# Altium schematic sheet 15_PowerSupply.SchDoc: Board power supply (part 2 of 3)
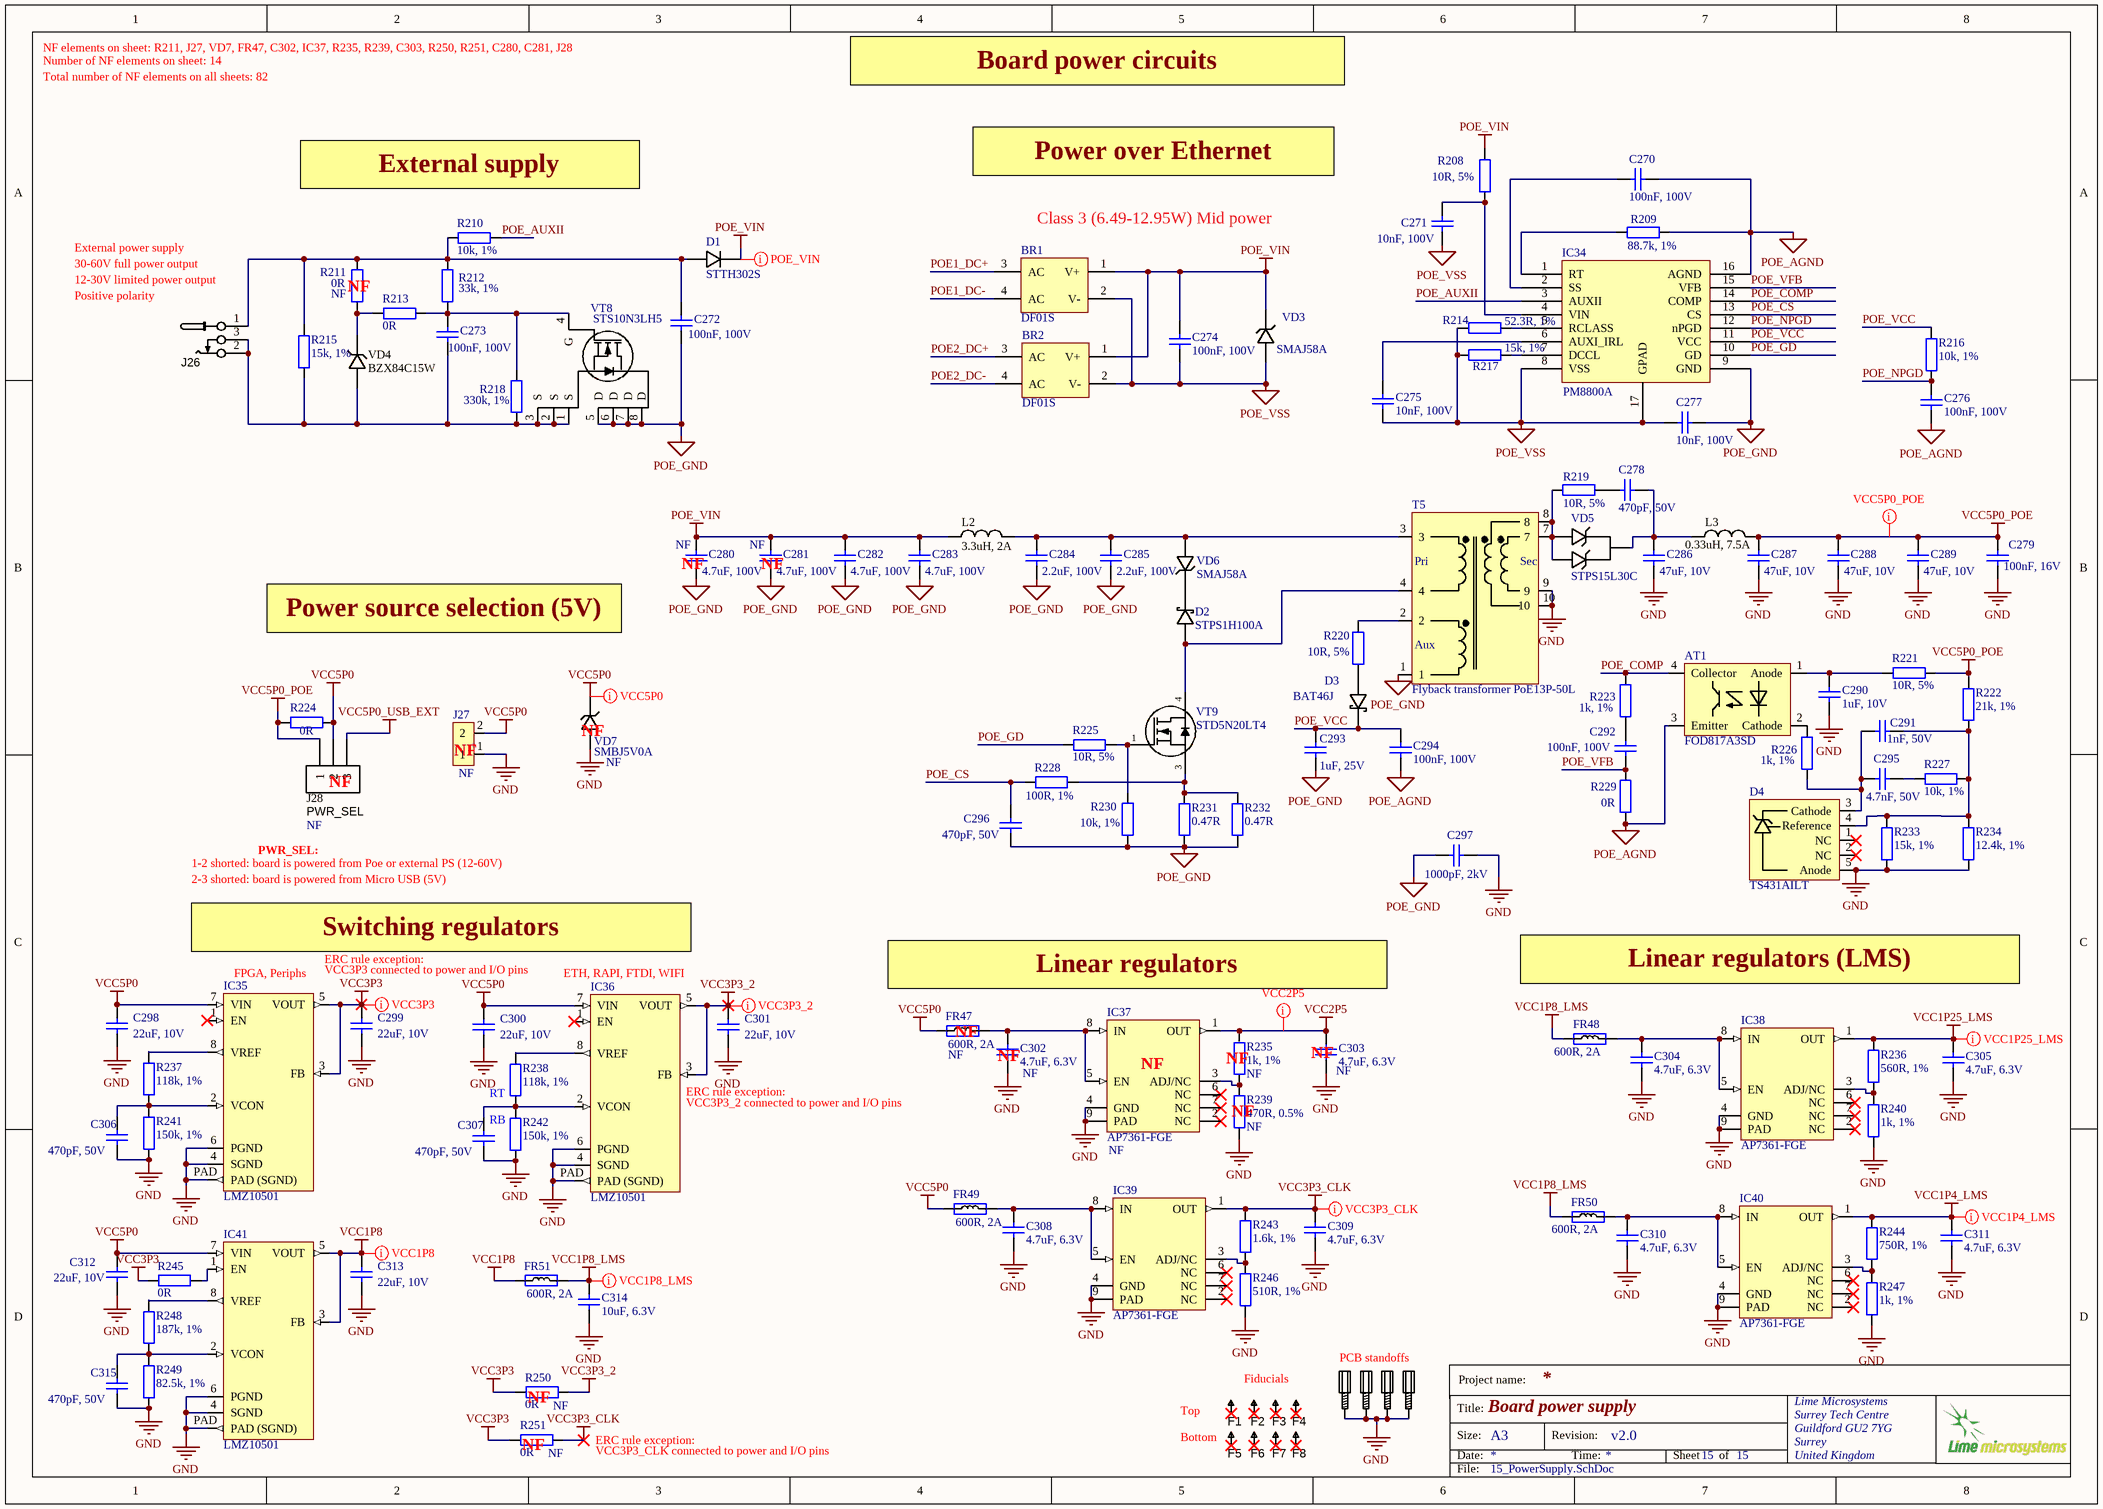
[diagram p1: 15_PowerSupply.SchDoc]
## Library data of the parts
AT1 = FOD817A3SD_optoisolator: Manufacturer: ON Semiconductor / Fairchild; Part Description: Optoisolator Transistor Output 5000Vrms 1 Channel 4-SMD; Number of Channels: 1; Output Voltage: 70V; Forward Current: 50mA; Forward Voltage: 1.4V; Reverse Breakdown Voltage: 6V; Rise Time: 18000ns; Max Power Dissipation: 200mW; Collector Emitter Voltage (VCEO): 200mV; Isolation Voltage: 5kV; Current Transfer Ratio: 160%; Supplier 1: Digi-Key; Manufacturer Part Number 1: FOD817A3SD; Stock 1: 0; Mount: Surface Mount; Case/Package: SMD/SMT; Number of Pins: 4; Weight: 0g; Contact Plating: Matte,Tin; Min Operating Temperature: -55°C; Max Operating Temperature: 110°C; Packaging: Tape and Reel; Package Quantity: 1000; Output Current per Channel: 50mA; Max Collector Current: 50mA; Collector Emitter Saturation Voltage: 200mV; Reverse Voltage (DC): 6V; Fall Time: 18000ns; Number of Elements: 1; Power Dissipation: 200mW; Max Input Current: 50mA; Max Output Voltage: 70V; Input Current: 50mA; Number of Circuits: 1; Radiation Hardening: No; REACH SVHC: No SVHC; Lead Free: Lead Free; ComponentLink1URL: https://www.verical.com/server-webapp/html/getDatasheet?partID=312696; ComponentLink1Description: https://www.verical.com/server-webapp/html/getDatasheet?partID=312696; ComponentLink2URL: https://www.fairchildsemi.com/datasheets/FO/FOD817A.pdf; ComponentLink2Description: https://www.fairchildsemi.com/datasheets/FO/FOD817A.pdf; ComponentLink3URL: http://www.fairchildsemi.com/ds/FO/FOD817A.pdf; ComponentLink3Description: http://www.fairchildsemi.com/ds/FO/FOD817A.pdf; ComponentLink4URL: http://www.fairchildsemi.com/datasheets/FO/FOD817A.pdf; ComponentLink4Description: http://www.fairchildsemi.com/datasheets/FO/FOD817A.pdf; ComponentLink5URL: http://www.mouser.com/ds/2/149/FOD817A-194238.pdf; ComponentLink5Description: http://www.mouser.com/ds/2/149/FOD817A-194238.pdf; ComponentLink6URL: https://www.fairchildsemi.com/datasheets/FO/FOD817D.pdf; ComponentLink6Description: https://www.fairchildsemi.com/datasheets/FO/FOD817D.pdf; Supplier Part Number 1: FOD817A3SDDKR-ND
BR1 BR2 = Bridge2: Diode Bridge; Part Description: Bridge Rectifier Single Phase Standard 100V Surface Mount DF-S; Vf - Forward Voltage: 1.1 V; Vr - Reverse Voltage: 70 V; Peak Reverse Voltage: 100 V; Brand: Diodes Incorporated; Max Surge Current: 50 A; Unit Weight: 0.010547 oz; Ir - Reverse Current: 10 uA; Package / Case: DFS; Product: Bridge Rectifiers; Width: 6.5 mm; Termination Style: SMD/SMT; Product Category: Bridge Rectifiers; Type: Single Phase Bridge; Height: 3.4 mm; Packaging: Tube; Manufacturer: Diodes Incorporated; Series: DF01; Length: 8.51 mm; Supplier Part Number 1: DF01SDI-ND; Factory Pack Quantity: 50; Mounting Style: PCB Mount; Manufacturer Part Number 1: DF01S; RoHS: True; Minimum Operating Temperature: - 65 C; Supplier 1: Digi-Key; Maximum Operating Temperature: + 150 C
C270 C272-C274 C276 C292 C294 = Cap_0805: Manufacturer: Murata Electronics North America; Part Description: 0.1µF ±10% 100V Ceramic Capacitor X7R 0805 (2012 Metric); Manufacturer Part Number 1: GCM21BR72A104KA37K; Temperature Coefficient: X7R; Tolerance: ±10%; Package / Case: 0805 (2012 Metric); Size / Dimension: 0.079" L x 0.049" W (2.00mm x 1.25mm); Lead Style: -; Height - Seated (Max): -; Thickness (Max): 0.055" (1.40mm); Lead Spacing: -; Ratings: AEC-Q200; Supplier Part Number 1: 490-8051-1-ND; Features: -; Operating Temperature: -55°C ~ 125°C; Supplier 1: Digi-Key; RoHS: RoHS Compliant; Part Status: Active; Mounting Type: Surface Mount, MLCC; Category: Capacitors; Packaging: Cut Tape (CT); Applications: Automotive; Voltage - Rated: 100V; Value: 100nF, 100V
C271 C275 C277 = Cap_0603: Manufacturer: Murata Electronics North America; Manufacturer Part Number 1: GCM188R72A103KA37J; Part Description: 10000pF ±10% 100V Ceramic Capacitor X7R 0603 (1608 Metric); Tolerance: ±10%; Temperature Coefficient: X7R; Assembly Info: *; Packaging: Cut Tape (CT); Ratings: AEC-Q200; Supplier Part Number 1: 490-8028-1-ND; Size / Dimension: 0.063" L x 0.031" W (1.60mm x 0.80mm); Applications: Automotive; Voltage - Rated: 100V; Height - Seated (Max): -; Lead Style: -; Category: Capacitors; RoHS: RoHS Compliant; Package / Case: 0603 (1608 Metric); Operating Temperature: -55°C ~ 125°C; Lead Spacing: -; Supplier 1: Digi-Key; Features: -; Thickness (Max): 0.035" (0.90mm); Mounting Type: Surface Mount, MLCC; Part Status: Active; Value: 10nF, 100V
C278 C296 C306 C307 C315 = Cap_0402: Manufacturer Part Number: C1005C0G1H471J050BA; Manufacturer: TDK Corporation; Part Description: 470pF ±5% 50V Ceramic Capacitor C0G, NP0 0402 (1005 Metric); Tolerance: ±5%; Temperature Coefficient: C0G, NP0; Value: 470pF, 50V; Supplier 1: Digi-Key; Supplier Part Number 1: 445-2656-6-ND; Ratings: -; Package / Case: 0402 (1005 Metric); Capacitance: 470pF; Packaging: Digi-Reel®; RoHS: RoHS Compliant; Lead Style: -; Thickness (Max): 0.022" (0.55mm); Size / Dimension: 0.039" L x 0.020" W (1.00mm x 0.50mm); Lead Spacing: -; Operating Temperature: -55°C ~ 125°C; Height - Seated (Max): -; Applications: General Purpose; Mounting Type: Surface Mount, MLCC; Voltage - Rated: 50V; Category: Capacitors; Features: -
C279 = Cap_0402: Manufacturer: Murata Electronics; Manufacturer Part Number: GRM155R71C104KA88D; Part Description: CAP CER 0.1UF 16V X7R 0402; Tolerance: 10 %; Type: General Purpose MLCC; Capacitance: 0.1 uF; Case Length: 1 mm; Dielectric: X7R; Case Height: 0.5 mm; Temperature Coefficient / Code: +/- 15 %; Value: 100nF, 16V; Supplier 1: Mouser; Supplier Part Number 1: 81-GRM155R71C104KA88; Case Code - in: 0402; RoHS: RoHS Compliant; Operating Temperature Range: - 55 C to + 125 C; Series: GRM; Termination Style: SMD/SMT; Package / Case: 0402 (1005 metric); Voltage Rating DC: 16 V; Maximum Operating Temperature: + 125 C; Case Code - mm: 1005; Minimum Operating Temperature: - 55 C; Product Category: Low & Medium Capacitance SMD Ceramic Chip Capacitors; Packaging: Reel; Product: General Type MLCCs; Category: Multilayer Ceramic Capacitors MLCC - SMD/SMT; Brand: Murata Electronics; Case Width: 0.5 mm; RoHS - Mouser: Y; Standard Pack Qty: 10000; Minimum Order Quantity: 1; Reeling: True; Manufacturer Part Number 1: GRM155R71C104KA88D
C280-C283 = Cap_1206: Manufacturer: TDK Corporation; Part Description: 4.7µF ±20% 100V Ceramic Capacitor X7S 1210 (3225 Metric); Manufacturer Part Number 1: C3225X7S2A475M200AB; Tolerance: ±20%; Temperature Coefficient: X7S; Notification: Current market demand for these product types have resulted in fluctuating and extending lead times. Lead times may differ.; Value: 4.7uF, 100V; Category: Capacitors; Supplier Part Number 1: 445-6043-1-ND; Supplier 1: Digi-Key; RoHS: RoHS Compliant; Packaging: Cut Tape (CT); Part Status: Active; Voltage - Rated: 100V; Operating Temperature: -55°C ~ 125°C; Features: -; Ratings: -; Applications: General Purpose; Failure Rate: -; Mounting Type: Surface Mount, MLCC; Package / Case: 1210 (3225 Metric); Size / Dimension: 0.126" L x 0.098" W (3.20mm x 2.50mm); Height - Seated (Max): -; Thickness (Max): 0.087" (2.20mm); Lead Spacing: -; Lead Style: -
C284 C285 = Cap_1206: Manufacturer: TDK Corporation; Part Description: 2.2µF ±10% 100V Ceramic Capacitor X7S 1206 (3216 Metric); Manufacturer Part Number 1: C3216X7S2A225K160AE; Temperature Coefficient: X7S; Tolerance: ±10%; Size / Dimension: 0.126" L x 0.063" W (3.20mm x 1.60mm); Packaging: Cut Tape (CT); Voltage - Rated: 100V; Category: Capacitors; Operating Temperature: -55°C ~ 125°C; Mounting Type: Surface Mount, MLCC; Lead Spacing: -; Ratings: -; Supplier Part Number 1: 445-8900-1-ND; Lead Style: -; Height - Seated (Max): -; Supplier 1: Digi-Key; Applications: Boardflex Sensitive; Features: Soft Termination; RoHS: RoHS Compliant; Part Status: Active; Thickness (Max): 0.075" (1.90mm); Failure Rate: -; Package / Case: 1206 (3216 Metric); Value: 2.2uF, 100V
C286-C289 = Cap_1206: Manufacturer: TDK Corporation; Manufacturer Part Number 1: C3216X6S1A476M160AC; Part Description: 47µF ±20% 10V Ceramic Capacitor X6S 1206 (3216 Metric); Notification: Current market demand for these product types have resulted in fluctuating and extending lead times. Lead times may differ.; Tolerance: ±20%; Temperature Coefficient: X6S; Value: 47uF, 10V; RoHS: RoHS Compliant; Packaging: Cut Tape (CT); Operating Temperature: -55°C ~ 105°C; Voltage - Rated: 10V; Height - Seated (Max): -; Ratings: -; Applications: General Purpose; Features: Low ESL; Size / Dimension: 0.126" L x 0.063" W (3.20mm x 1.60mm); Supplier 1: Digi-Key; Lead Spacing: -; Supplier Part Number 1: 445-6010-1-ND; Thickness (Max): 0.071" (1.80mm); Failure Rate: -; Category: Capacitors; Lead Style: -; Part Status: Active; Mounting Type: Surface Mount, MLCC; Package / Case: 1206 (3216 Metric)
C290 = Cap_0402: CAP CER 1UF 10V X5R 0402; Manufacturer: Yageo; Part Description: 1µF 10V Ceramic Capacitor X5R 0402 (1005 Metric) 0.039" L x 0.020" W (1.00mm x 0.50mm); Manufacturer Part Number: CC0402MRX5R6BB105; Notification: Current market demand for these product types have resulted in fluctuating and extending lead times. Lead times may differ.; Tolerance: ±20%; Value: 1uF, 10V; Supplier 1: Digi-Key; Supplier Part Number 1: 311-1732-1-ND; RoHS: RoHS Compliant; Applications: General Purpose; Category: Capacitors; ComponentLink1Description: http://www.yageo.com/documents/recent/UPY-GPHC_X5R_4V-to-50V_25.pdf; ComponentLink1URL: http://www.yageo.com/documents/recent/UPY-GPHC_X5R_4V-to-50V_25.pdf; Failure Rate: -; Features: -; Height - Seated (Max): -; Lead Spacing: -; Lead Style: -; Mounting Type: Surface Mount, MLCC; Operating Temperature: -55°C ~ 85°C; Package / Case: 0402 (1005 Metric); Packaging: Cut Tape (CT); Part Status: Active; Pricing 1: 1=0.22, 10=0.156, 100=0.0732, 500=0.0513, 1000=0.04248, 2500=0.03953, 5000=0.03617 (USD); Ratings: -; Size / Dimension: 0.039" L x 0.020" W (1.00mm x 0.50mm); Stock 1: 69600; Temperature Coefficient: X5R; Thickness (Max): 0.022" (0.55mm); Voltage - Rated: 10V
C291 = Cap_0402: Manufacturer: Murata Electronics North America; Part Description: 1000pF ±10% 50V Ceramic Capacitor X7R 0402 (1005 Metric); Manufacturer Part Number 1: GCM155R71H102KA37D; Temperature Coefficient: X7R; Tolerance: ±10%; Height - Seated (Max): -; Operating Temperature: -55°C ~ 125°C; Ratings: AEC-Q200; Package / Case: 0402 (1005 Metric); Lead Style: -; Size / Dimension: 0.039" L x 0.020" W (1.00mm x 0.50mm); Lead Spacing: -; Thickness (Max): 0.022" (0.55mm); Mounting Type: Surface Mount, MLCC; Features: -; Voltage - Rated: 50V; Applications: Automotive; Part Status: Active; Packaging: Cut Tape (CT); RoHS: RoHS Compliant; Category: Capacitors; Supplier Part Number 1: 490-4761-1-ND; Supplier 1: Digi-Key; Value: 1nF, 50V
C293 = Cap_0603: Manufacturer: Samsung Electro-Mechanics; Manufacturer Part Number 1: CL10A105KA8NNNC; Part Description: 1µF ±10% 25V Ceramic Capacitor X5R 0603 (1608 Metric); Notification: Current market demand for these product types have resulted in fluctuating and extending lead times. Lead times may differ.; Temperature Coefficient: X5R; Tolerance: ±10%; Lead Spacing: -; Lead Style: -; Thickness (Max): 0.035" (0.90mm); Features: -; Operating Temperature: -55°C ~ 85°C; Size / Dimension: 0.063" L x 0.031" W (1.60mm x 0.80mm); Height - Seated (Max): -; Applications: General Purpose; Mounting Type: Surface Mount, MLCC; Package / Case: 0603 (1608 Metric); Ratings: -; Supplier Part Number 1: 1276-1102-1-ND; Packaging: Cut Tape (CT); Voltage - Rated: 25V; RoHS: RoHS Compliant; Supplier 1: Digi-Key; Category: Capacitors; Part Status: Active; Value: 1uF, 25V
C295 = Cap_0402: Manufacturer: Murata Electronics North America; Manufacturer Part Number 1: GCM155R71H472KA37D; Part Description: 4700pF ±10% 50V Ceramic Capacitor X7R 0402 (1005 Metric); Tolerance: ±10%; Temperature Coefficient: X7R; Voltage - Rated: 50V; Packaging: Cut Tape (CT); Operating Temperature: -55°C ~ 125°C; Package / Case: 0402 (1005 Metric); Thickness (Max): 0.022" (0.55mm); Features: -; Supplier Part Number 1: 490-4915-1-ND; Ratings: AEC-Q200; Applications: Automotive; Size / Dimension: 0.039" L x 0.020" W (1.00mm x 0.50mm); Part Status: Active; Lead Spacing: -; Lead Style: -; Supplier 1: Digi-Key; Height - Seated (Max): -; Mounting Type: Surface Mount, MLCC; RoHS: RoHS Compliant; Category: Capacitors; Value: 4.7nF, 50V
C297 = Cap_1206: Manufacturer Part Number 1: C1812C102KGRACTU; Manufacturer: KEMET; Part Description: 1000pF ±10% 2000V (2kV) Ceramic Capacitor X7R 1812 (4532 Metric); Tolerance: ±10%; Notification: Current market demand for these product types have resulted in fluctuating and extending lead times. Lead times may differ.; Voltage - Rated: 2000V (2kV); Temperature Coefficient: X7R; Packaging: Cut Tape (CT); Supplier Part Number 1: 399-3447-1-ND; Supplier 1: Digi-Key; Part Status: Active; Category: Capacitors; RoHS: RoHS Compliant; Mounting Type: Surface Mount, MLCC; Applications: General Purpose; Lead Style: -; Ratings: -; Height - Seated (Max): -; Thickness (Max): 0.061" (1.55mm); Size / Dimension: 0.177" L x 0.126" W (4.50mm x 3.20mm); Package / Case: 1812 (4532 Metric); Failure Rate: -; Lead Spacing: -; Features: High Voltage; Operating Temperature: -55°C ~ 125°C; Value: 1000pF, 2kV
C298-C301 C312 C313 = Cap_0603: Manufacturer Part Number 1: C1608X5R1A226M080AC; Manufacturer: TDK Corporation; Part Description: 22µF ±20% 10V X5R Ceramic Capacitor -55°C ~ 85°C Surface Mount, MLCC 0603 (1608 Metric) 0.063" L x 0.031" W (1.60mm x 0.80mm); Brand: TDK; Temperature Coefficient / Code: +/- 15 %; Tolerance: 20 %; Type: Multilayer Ceramic Chip Capacitor; Supplier 1: Mouser; Supplier Part Number 1: 810-C1608X5R1A226M; Package / Case: 0603 (1608 metric); Category: Multilayer Ceramic Capacitors MLCC - SMD/SMT; Capacitance: 22 uF; Operating Temperature Range: - 55 C to + 85 C; Case Code - in: 0603; Voltage Rating DC: 10 V; Case Code - mm: 1608; Value: 22uF, 10V
C302-C305 C308-C311 = Cap_0402: Manufacturer: Murata Electronics North America; Manufacturer Part Number: GRM155R60J475ME87D; Part Description: 4.7µF ±20% 6.3V X5R Ceramic Capacitor -55°C ~ 85°C Surface Mount, MLCC 0402 (1005 Metric) 0.039" L x 0.020" W (1.00mm x 0.50mm); Tolerance: ±20%; Capacitance: 4.7µF; Temperature Coefficient: X5R; Lead Style: -; Ratings: -; Height - Seated (Max): -; Thickness (Max): 0.022" (0.55mm); Voltage - Rated: 6.3V; Packaging: Cut Tape (CT); Lead Spacing: -; Category: Capacitors; Supplier Part Number 1: 490-5408-1-ND; Applications: General Purpose; Operating Temperature: -55°C ~ 85°C; Mounting Type: Surface Mount, MLCC; Features: Derating Recommended; RoHS: RoHS Compliant; Supplier 1: Digi-Key; Package / Case: 0402 (1005 Metric); Size / Dimension: 0.039" L x 0.020" W (1.00mm x 0.50mm); Value: 4.7uF, 6.3V
C314 = Cap_0603: Manufacturer Part Number 1: CC0603MRX5R5BB106; Manufacturer: Yageo; Part Description: 10µF ±20% 6.3V X5R Ceramic Capacitor -55°C ~ 85°C Surface Mount, MLCC 0603 (1608 Metric) 0.063" L x 0.031" W (1.60mm x 0.80mm); Capacitance: 10µF; Tolerance: ±20%; Supplier 1: Digi-Key; Supplier Part Number 1: 311-1448-2-ND; Package / Case: 0603 (1608 Metric); Category: Capacitors; Voltage - Rated: 6.3V; Value: 10uF, 6.3V
D1 = STTH302S_diode: Part Description: Diode Standard 200V 3A Surface Mount SMC; Manufacturer: STMicroelectronics; Max Surge Current: 100A; Recovery Time: 35ns; Forward Voltage: 950mV; Forward Current: 3A; Peak Reverse Current: 3uA; Max Repetitive Reverse Voltage (Vrrm): 200V; Element Configuration: Single; Polarity: Standard; Supplier 1: Digi-Key; Manufacturer Part Number 1: STTH302S; Stock 1: 8931; Pricing 1: 1=0.78, 10=0.683, 100=0.5237, 500=0.414, 1000=0.3312 (USD); Mount: Stud,Surface Mount; Case/Package: SMC; Number of Pins: 2; Min Operating Temperature: -65°C; Max Operating Temperature: 175°C; Package Quantity: 1; Packaging: Tape and Reel; Average Rectified Current: 3A; Reverse Recovery Time: 35ns; Peak Non-Repetitive Surge Current: 100A; Max Forward Surge Current (Ifsm): 100A; Voltage Rating (DC): 200V; Current Rating: 3A; Output Current: 3A; Reverse Voltage: 200V; Max Reverse Voltage (DC): 200V; Length: 7.15mm; Height: 2.45mm; Width: 6.25mm; Radiation Hardening: No; REACH SVHC: No SVHC; Lead Free: Lead Free; ComponentLink1URL: http://www.st.com/web/catalog/sense_power/FM64/CL830/SC4/PF70422?referrer=70032480; ComponentLink1Description: http://www.st.com/web/catalog/sense_power/FM64/CL830/SC4/PF70422?referrer=70032480; ComponentLink2URL: http://www.st.com/st-web-ui/static/active/en/resource/technical/document/datasheet/CD00002930.pdf; ComponentLink2Description: http://www.st.com/st-web-ui/static/active/en/resource/technical/document/datasheet/CD00002930.pdf; ComponentLink3URL: https://www.distrelec.biz/Web/Downloads/29/30/CD00002930.pdf?mime=application%2Fpdf; ComponentLink3Description: https://www.distrelec.biz/Web/Downloads/29/30/CD00002930.pdf?mime=application%2Fpdf; ComponentLink4URL: http://www.st.com/content/ccc/resource/technical/document/datasheet/bc/ad/88/88/7d/b3/47/3b/CD00002930.pdf/files/CD00002930.pdf/jcr:content/translations/en.CD00002930.pdf; ComponentLink4Description: http://www.st.com/content/ccc/resource/technical/document/datasheet/bc/ad/88/88/7d/b3/47/3b/CD00002930.pdf/files/CD00002930.pdf/jcr:content/translations/en.CD00002930.pdf; Supplier Part Number 1: 497-5230-6-ND
D2 = STPS1H100A_shottky_diode: Part Description: Diode Schottky 100V 1A Surface Mount SMA (DO-214AC); Manufacturer: STMicroelectronics; Forward Current: 1A; Max Surge Current: 50A; Forward Voltage: 620mV; Peak Reverse Current: 4uA; Max Repetitive Reverse Voltage (Vrrm): 100V; Element Configuration: Single; Polarity: Standard; Supplier 1: Digi-Key; Manufacturer Part Number 1: STPS1H100A; Stock 1: 171196; Pricing 1: 1=0.46, 10=0.397, 100=0.2965, 500=0.23294, 1000=0.18 (USD); Mount: Surface Mount; Case/Package: SMA; Number of Pins: 2; Weight: 0.01lb; Contact Plating: Matte,Tin; Min Operating Temperature: -65°C; Max Operating Temperature: 175°C; Package Quantity: 1; Packaging: Tape and Reel; Average Rectified Current: 1A; Max Reverse Leakage Current: 4uA; Max Forward Surge Current (Ifsm): 50A; Peak Non-Repetitive Surge Current: 50A; Termination: SMD/SMT; Voltage Rating (DC): 100V; Output Current: 1A; Current Rating: 1A; Max Reverse Voltage (DC): 100V; Length: 4.6mm; Height: 2.03mm; Width: 2.95mm; Radiation Hardening: No; REACH SVHC: No SVHC; Lead Free: Lead Free; ComponentLink1URL: https://www.distrelec.biz/Web/Downloads/13/04/CD00001304.pdf?mime=application%2Fpdf; ComponentLink1Description: https://www.distrelec.biz/Web/Downloads/13/04/CD00001304.pdf?mime=application%2Fpdf; ComponentLink2URL: http://www.st.com/content/ccc/resource/technical/document/datasheet/e8/3c/6a/07/72/b0/40/88/CD00001304.pdf/files/CD00001304.pdf/jcr:content/translations/en.CD00001304.pdf; ComponentLink2Description: http://www.st.com/content/ccc/resource/technical/document/datasheet/e8/3c/6a/07/72/b0/40/88/CD00001304.pdf/files/CD00001304.pdf/jcr:content/translations/en.CD00001304.pdf; ComponentLink3URL: http://www.farnell.com/datasheets/1690209.pdf; ComponentLink3Description: http://www.farnell.com/datasheets/1690209.pdf; Supplier Part Number 1: 497-3209-6-ND
D3 = BAT46JFILM_shottky_diode: Manufacturer: STMicroelectronics; Part Description: Diode Schottky 100V 150mA (DC) Surface Mount SOD-323; Diode Type: Schottky; Current - Average Rectified (Io): 150mA (DC); Speed: Small Signal =< 200mA (Io), Any Speed; Capacitance @ Vr, F: 10pF @ 0V, 1MHz; Supplier 1: Digi-Key; Supplier Part Number 1: 497-6653-6-ND; Manufacturer Part Number 1: BAT46JFILM; RoHS: RoHS Compliant; Category: Discrete Semiconductor Products; Stock 1: 137606; Pricing 1: 1=0.48, 10=0.36, 100=0.2074, 500=0.14, 1000=0.1092 (USD); Packaging: Digi-Reel®; Part Status: Active; Mounting Type: Surface Mount; Package / Case: SC-76, SOD-323; Supplier Device Package: SOD-323; Operating Temperature - Junction: 150°C (Max); Base Part Number: BAT46; ComponentLink1URL: http://www.st.com/content/ccc/resource/technical/document/datasheet/c6/32/d4/4a/28/d3/4b/11/CD00004930.pdf/files/CD00004930.pdf/jcr:content/translations/en.CD00004930.pdf; ComponentLink1Description: http://www.st.com/content/ccc/resource/technical/document/datasheet/c6/32/d4/4a/28/d3/4b/11/CD00004930.pdf/files/CD00004930.pdf/jcr:content/translations/en.CD00004930.pdf
D4 = TS431AILT_VREF_ADJ: Manufacturer: STMicroelectronics; Part Description: Shunt Voltage Reference IC 6V ±1% 30mA SOT-23-5; Nominal Supply Current: 30mA; Output Voltage: 6V; Max Input Voltage: 10V; Number of Channels: 1; Tolerance: 1%; Temperature Coefficient: 100ppm/°C; Cathode Current: 60uA; Reference Voltage: 1.24V; Min Output Voltage: 1.228V; Reference Type: Adjustable,Shunt; Supplier 1: Digi-Key; Manufacturer Part Number 1: TS431AILT; Stock 1: 5120; Pricing 1: 1=0.62, 10=0.533, 100=0.398, 500=0.3127, 1000=0.24164 (USD); Mount: Surface Mount; Case/Package: SOT-23-5; Number of Pins: 5; Min Operating Temperature: -40°C; Max Operating Temperature: 125°C; Packaging: Tape and Reel; Max Output Current: 30mA; Package Quantity: 1; Output Current: 30mA; Max Output Voltage: 6V; Termination: SMD/SMT; Length: 3mm; Height: 1.3mm; Width: 1.75mm; Radiation Hardening: No; REACH SVHC: No SVHC; Lead Free: Lead Free; ComponentLink1URL: https://www.verical.com/server-webapp/html/getDatasheet?partID=139054; ComponentLink1Description: https://www.verical.com/server-webapp/html/getDatasheet?partID=139054; ComponentLink2URL: http://www.st.com/content/ccc/resource/technical/document/datasheet/group1/3f/2e/70/d8/11/ee/47/a9/CD00001336/files/CD00001336.pdf/jcr:content/translations/en.CD00001336.pdf; ComponentLink2Description: http://www.st.com/content/ccc/resource/technical/document/datasheet/group1/3f/2e/70/d8/11/ee/47/a9/CD00001336/files/CD00001336.pdf/jcr:content/translations/en.CD00001336.pdf; ComponentLink3URL: http://www.st.com/web/en/resource/technical/document/datasheet/CD00001336.pdf; ComponentLink3Description: http://www.st.com/web/en/resource/technical/document/datasheet/CD00001336.pdf; ComponentLink4URL: http://www.farnell.com/datasheets/1700526.pdf; ComponentLink4Description: http://www.farnell.com/datasheets/1700526.pdf; ComponentLink5URL: http://www.mouser.com/ds/2/389/ts431-957324.pdf; ComponentLink5Description: http://www.mouser.com/ds/2/389/ts431-957324.pdf; ComponentLink6URL: http://www.produktinfo.conrad.com/datenblaetter/1100000-1199999/001185084-da-01-en-IC_VREF_SHUNT_PRE_TS431AILT_SOT_23_5_STM.pdf; ComponentLink6Description: http://www.produktinfo.conrad.com/datenblaetter/1100000-1199999/001185084-da-01-en-IC_VREF_SHUNT_PRE_TS431AILT_SOT_23_5_STM.pdf; ComponentLink7URL: http://datasheet.iiic.cc/stmicroelectronics/TS431AILT.pdf; ComponentLink7Description: http://datasheet.iiic.cc/stmicroelectronics/TS431AILT.pdf; Supplier Part Number 1: 497-2279-6-ND
FR47-FR51 = Ferrite: Manufacturer Part Number 1: MPZ2012S601AT000; Manufacturer: TDK Corporation; Part Description: FERRITE BEAD 600 OHM 0805 1LN; Filter Type: Differential Mode - Single; Impedance @ Frequency: 600 Ohm @ 100MHz; DC Resistance (DCR): 100 mOhm Max; Supplier 1: Digi-Key; Supplier Part Number 1: 445-2206-2-ND; Mounting Type: Surface Mount; RoHS: RoHS Compliant; Height (Max): 0.041" (1.05mm); Packaging: Tape & Reel (TR); Category: Filters; Current Rating: 2A; Package / Case: 0805 (2012 Metric); Size / Dimension: 0.079" L x 0.049" W (2.00mm x 1.25mm)
  FR48 FR50: Value: 600R, 2A
IC34 = PM8800A: Manufacturer: STMicroelectronics; Part Description: Power Over Ethernet Controller 1 Channel 802.3af (PoE) 16-HTSSOP; Internal Switch(s): No; Other Related Documents: PM8800 View All Specifications; Current Limit: 800mA; Voltage - Supply: -; Category: Integrated Circuits (ICs); Supplier Part Number 1: 497-16438-ND; Supplier Device Package: 16-HTSSOP; Family: PMIC - Hot Swap, PoE Controllers; Package / Case: 16-TSSOP (0.173", 4.40mm Width) Exposed pad; Supplier: Digi-Key; Type: Power Over Ethernet Controller (PoE); Standard Package: 1,920; Series: -; Mounting Type: Surface Mount; Operating Temperature: -40°C ~ 85°C; Manufacturer Part Number 1: PM8800A; Applications: General Purpose; Packaging: Tape & Reel (TR)
IC35 IC36 IC41 = LMZ10501: Manufacturer: Texas Instruments; Manufacturer Part Number: LMZ10501SILR; Part Description: n  Non-Isolated PoL Module DC DC Converter 1 Output 0.6 ~ 3.6 V 1A 2.7V - 5.5V Input; Voltage - Input (Min): 2.7V; Voltage - Input (Max): 5.5V; Voltage - Output 1: 0.6 ~ 3.6 V; Current - Output (Max): 1A; Efficiency: 95%; Supplier 1: Digi-Key; RoHS: RoHS Compliant; Category: Power Supplies - Board Mount; Stock 1: 26559; Pricing 1: 1=2.46, 5=2.424, 10=2.388, 25=2.318, 50=2.2478, 100=2.1776, 250=2.1074, 500=1.96688 (USD); Packaging: Cut Tape (CT); Part Status: Active; Type: Non-Isolated PoL Module; Voltage - Output 2: -; Voltage - Output 3: -; Applications: ITE (Commercial); Features: OCP, OTP, UVLO; Operating Temperature: -40°C ~ 125°C; Mounting Type: Surface Mount; Package / Case: 8-LDFN Exposed Pad, Module; Size / Dimension: 0.12" L x 0.10" W x 0.03" H (3.0mm x 2.5mm x 0.7mm); Supplier Device Package: 8-uSIP; ComponentLink1URL: http://www.ti.com/lit/ds/symlink/lmz10501.pdf; ComponentLink1Description: http://www.ti.com/lit/ds/symlink/lmz10501.pdf; Supplier Part Number 1: 296-37104-1-ND
IC37 = AP7361: Manufacturer Part Number: AP7361-FGE-7; Manufacturer: Diodes Incorporated; Part Description: IC REG LDO ADJ 1A 8DFN; Regulator Topology: Positive Adjustable; Current - Output: 1A; Current - Limit (Min): 1.1A; Voltage - Dropout (Typical): 0.5V @ 1A; Voltage - Output: 0.8 V ~ 5.5 V; Number of Regulators: 1; Voltage - Input: 2.2 V ~ 6 V; Supplier 1: Digi-Key; Supplier Part Number 1: AP7361-FGE-7DICT-ND; RoHS: RoHS Compliant; Supplier Device Package: U-DFN3030-8; Mounting Type: Surface Mount; Category: Integrated Circuits (ICs); Packaging: Cut Tape (CT); Package / Case: 8-UDFN Exposed Pad; Operating Temperature: -40°C ~ 85°C
IC38-IC40 = AP7361: Manufacturer Part Number 1: AP7361-FGE-7; Manufacturer: Diodes Incorporated; Part Description: IC REG LDO ADJ 1A 8DFN; Regulator Topology: Positive Adjustable; Current - Output: 1A; Current - Limit (Min): 1.1A; Voltage - Dropout (Typical): 0.5V @ 1A; Voltage - Output: 0.8 V ~ 5.5 V; Number of Regulators: 1; Voltage - Input: 2.2 V ~ 6 V; Supplier 1: Digi-Key; Supplier Part Number 1: AP7361-FGE-7DICT-ND; RoHS: RoHS Compliant; Supplier Device Package: U-DFN3030-8; Mounting Type: Surface Mount; Category: Integrated Circuits (ICs); Packaging: Cut Tape (CT); Package / Case: 8-UDFN Exposed Pad; Operating Temperature: -40°C ~ 85°C
J26 = CONN_PWR_JACK_2.1x5.5mm: Power Connector, THT, 2.1mm ID, 5.5mm OD; Part Description: DC Power Connector, Jack, 5 A, 2.5 mm, Through Hole Mount, Solder; Manufacturer: Switchcraft; Manufacturer Part Number 1: RAPC712X; Description: CONN POWERJACK MINI R/A PCMT; Body Material: Thermoplastic; Current Rating: 5A; Gender: Male; Shielding: Unshielded; Connector Type: Jack,Power; Insulation Resistance: 30MR; Number of Ports: 1; Number of Contacts: 2; Supplier 1: Farnell; Supplier Part Number 1: 1608726; Stock 1: 6232; Pricing 1: 1=5.315 (EUR); Mount: Panel,PCB,Through Hole; Contact Material: Brass; Contact Plating: Nickel; Colour: Black; Number of Terminals: 3; Housing Colour: Black; Housing Material: Thermoplastic; Packaging: Bulk; Package Quantity: 2500; Max Current Rating: 5A; Contact Gender: Female; Termination: Solder; Orientation: Right Angle; Length: 9mm; Depth: 14.5mm; REACH SVHC: No SVHC; Lead Free: Lead Free; Flammability Rating: UL94 V-0; ComponentLink1URL: https://www.verical.com/server-webapp/html/getDatasheet?partID=110865; ComponentLink1Description: https://www.verical.com/server-webapp/html/getDatasheet?partID=110865; ComponentLink2URL: http://www.switchcraft.com/Documents/Jack_Schematics.pdf; ComponentLink2Description: http://www.switchcraft.com/Documents/Jack_Schematics.pdf
J27 = Jumper: Manufacturer Part Number 1: 961102-6404-AR; Part Description: 2 Positions Header, Unshrouded Connector 0.100" (2.54mm) Through Hole Gold; Manufacturer: 3M; Connector Type: Header, Unshrouded; Supplier 1: Digi-Key; Supplier Part Number 1: 3M9447-ND; Contact Type: Male Pin; Color: Black; Mounting Type: Through Hole; Category: Connectors, Interconnects; Contact Finish: Gold
J28 = Header3P: Header, 3-pin; Manufacturer: FCI; Manufacturer Part Number 1: 68000-103HLF; Part Description: Connector Header Through Hole 3 position 0.100" (2.54mm); Number of Positions Loaded: All; Connector Type: Header, Unshrouded; Number of Positions: 3; Pitch: 0.100" (2.54mm); Supplier 1: Digi-Key; Supplier Part Number 1: 609-3461-ND; RoHS: RoHS Compliant; Contact Type: Male Pin; Packaging: Bulk; Number of Rows: 1; Category: Connectors, Interconnects; Row Spacing: -; Termination: Solder; Contact Mating Length: 0.230" (5.84mm); Fastening Type: -; Mounting Type: Through Hole; Contact Finish Thickness: 30µin (0.76µm); Features: -; Contact Finish: Gold or Gold, GXT™; Color: Black
L2 = Inductor_0603: Manufacturer Part Number 1: NRS4018T3R3MDGJ; Manufacturer: Taiyo Yuden; Part Description: 3.3µH Shielded Wirewound Inductor 2A 66 mOhm Max Nonstandard; Frequency - Self Resonant: 45MHz; Current - Saturation: 2.3A; DC Resistance (DCR): 66 mOhm Max; Material - Core: Ferrite; Tolerance: ±20%; Type: Wirewound; Shielding: Shielded; Operating Temperature: -25°C ~ 120°C; Part Status: Active; Category: Inductors, Coils, Chokes; Supplier Part Number 1: 587-2892-1-ND; Mounting Type: Surface Mount; Supplier 1: Digi-Key; Packaging: Cut Tape (CT); Size / Dimension: 0.157" L x 0.157" W (4.00mm x 4.00mm); Package / Case: Nonstandard; Height - Seated (Max): 0.071" (1.80mm); Supplier Device Package: -; RoHS: RoHS Compliant; Q @ Freq: -; Ratings: -; Value: 3.3uH, 2A
L3 = Inductor_0603: Manufacturer: Pulse Electronics Power; Manufacturer Part Number: PA4336.331NLT; Part Description: 330nH Shielded  Inductor 3.3A 16 mOhm Max Nonstandard; DC Resistance (DCR): 16 mOhm Max; Tolerance: ±30%; Material - Core: Iron; Shielding: Shielded; Supplier Part Number 1: 553-3986-1-ND; Operating Temperature: -40°C ~ 125°C; Supplier 1: Digi-Key; Part Status: Active; Category: Inductors, Coils, Chokes; Q @ Freq: -; RoHS: RoHS Compliant; Type: -; Size / Dimension: 0.157" L x 0.157" W (4.00mm x 4.00mm); Frequency - Self Resonant: -; Height - Seated (Max): 0.079" (2.00mm); Package / Case: Nonstandard; Packaging: Cut Tape (CT); Supplier Device Package: -; Mounting Type: Surface Mount; Features: -; Ratings: -; Current - Saturation: 7.5A; Value: 0.33uH, 7.5A
MECH5-MECH8 = STANDOFF_M-F_THREADED_M3x8x10mm_HEX_5mm dia: STANDOFF M/F MET 5MM HEX 10MM L; Manufacturer: FIX&FASTEN; Manufacturer Part Number 1: FIX-MAE-5TV; Part Description: PCB distance; polyamide; L:5mm; Colour: natural; Øcutout:3mm; Unit: pcs; SuppliedAmount: 1000; MinAmount: 10; Type of spacer: PCB distance; Panel cutout diameter: 3mm; Spanner size: 5.5mm; Internal thread: M3; Thread pitch: 0,5; Supplier 1: TME; Supplier Part Number 1: FIX-MAE-5TV; Category: Plastic Pegs; Weight: 0.145; Multiples: 10; Material: polyamide; Spacer length: 5mm; Price Type: NET
R208 R219-R221 R225 = Res_0402: Manufacturer Part Number 1: RC0402JR-0710RL; Manufacturer: Yageo; Part Description: RES SMD 10 OHM 5% 1/16W 0402; Power (Watts): 0.063W, 1/16W; Resistance (Ohms): 10; Temperature Coefficient: ±200ppm/°C; Value: 10R, 5%; Supplier 1: Digi-Key; Supplier Part Number 1: 311-10JRTR-ND; Number of Terminations: 2; Height: 0.016" (0.40mm); RoHS: RoHS Compliant; Composition: Thick Film; Packaging: Tape & Reel (TR); Category: Resistors; Supplier Device Package: 0402; Features: Moisture Resistant; Tolerance: ±5%; Operating Temperature: -55°C ~ 155°C; Size / Dimension: 0.039" L x 0.020" W (1.00mm x 0.50mm); Package / Case: 0402 (1005 Metric)
R209 = Res_0402: Manufacturer Part Number 1: RC0402FR-0788K7L; Manufacturer: Yageo; Part Description: 88.7 kOhms ±1% 0.063W, 1/16W Chip Resistor 0402 (1005 Metric) Moisture Resistant Thick Film; Power (Watts): 0.063W, 1/16W; Temperature Coefficient: ±100ppm/°C; Value: 88.7k, 1%; Part Status: Active; Size / Dimension: 0.039" L x 0.020" W (1.00mm x 0.50mm); Failure Rate: -; Packaging: Cut Tape (CT); Tolerance: ±1%; Package / Case: 0402 (1005 Metric); Height - Seated (Max): 0.016" (0.40mm); Supplier Device Package: 0402; Operating Temperature: -55°C ~ 155°C; Composition: Thick Film; RoHS: RoHS Compliant; Features: Moisture Resistant; Supplier Part Number 1: 311-88.7KLRCT-ND; Category: Resistors; Supplier 1: Digi-Key
R210 R216 R227 R230 = Res_0402: Manufacturer: Yageo; Manufacturer Part Number 1: RC0402FR-0710KL; Part Description: RES SMD 10K OHM 1% 1/16W 0402; Temperature Coefficient: ±100ppm/°C; Power (Watts): 0.063W, 1/16W; Value: 10k, 1%; Supplier 1: Digi-Key; Supplier Part Number 1: 311-10.0KLRTR-ND; Resistance (Ohms): 10k; Packaging: Tape & Reel (TR); RoHS: RoHS Compliant; Package / Case: 0402 (1005 Metric); Tolerance: ±1%; Operating Temperature: -55°C ~ 155°C; Size / Dimension: 0.039" L x 0.020" W (1.00mm x 0.50mm); Number of Terminations: 2; Category: Resistors; Height: 0.016" (0.40mm); Supplier Device Package: 0402; Features: Moisture Resistant; Composition: Thick Film
R211 R213 = Res_0402: Manufacturer: Yageo; Part Description: RES SMD 0.0OHM JUMPER 1/16W 0402; Manufacturer Part Number 1: RC0402JR-070RL; Supplier 1: Digi-Key; Supplier Part Number 1: 311-0.0JRTR-ND; Composition: Thick Film; Package / Case: 0402 (1005 Metric); Category: Resistors; Value: 0R
R212 = Res_0402: Manufacturer Part Number 1: RC0402FR-0733KL; Manufacturer: Yageo; Part Description: 33 kOhms ±1% 0.063W, 1/16W Chip Resistor 0402 (1005 Metric) Moisture Resistant Thick Film; Power (Watts): 0.063W, 1/16W; Temperature Coefficient: ±100ppm/°C; Value: 33k, 1%; Supplier 1: Digi-Key; Features: Moisture Resistant; Height - Seated (Max): 0.016" (0.40mm); Part Status: Active; Supplier Device Package: 0402; Failure Rate: -; Size / Dimension: 0.039" L x 0.020" W (1.00mm x 0.50mm); RoHS: RoHS Compliant; Supplier Part Number 1: 311-33.0KLRCT-ND; Tolerance: ±1%; Package / Case: 0402 (1005 Metric); Category: Resistors; Operating Temperature: -55°C ~ 155°C; Composition: Thick Film; Packaging: Cut Tape (CT)
R214 = Res_0402: Manufacturer Part Number: RMCF0805FT52R3; Manufacturer: Stackpole Electronics Inc.; Temperature Coefficient: ±100ppm/°C; Power (Watts): 0.125W, 1/8W; RoHS: RoHS Compliant; Packaging: Cut Tape (CT); Category: Resistors; Supplier 1: Digi-Key; Supplier Part Number 1: RMCF0805FT52R3CT-ND; Tolerance: ±1%; Failure Rate: -; Part Status: Active; Operating Temperature: -55°C ~ 155°C; Height - Seated (Max): 0.026" (0.65mm); Features: Automotive AEC-Q200; Size / Dimension: 0.079" L x 0.049" W (2.00mm x 1.25mm); Composition: Thick Film; Supplier Device Package: 0805; Package / Case: 0805 (2012 Metric); Value: 52.3R, 1%
R215 R217 R233 = Res_0402: Manufacturer: Yageo; Manufacturer Part Number 1: RC0402FR-0715KL; Part Description: RES SMD 15K OHM 1% 1/16W 0402; Temperature Coefficient: ±100ppm/°C; Power (Watts): 0.063W, 1/16W; Value: 15k, 1%; Category: Resistors; Number of Terminations: 2; RoHS: RoHS Compliant; Features: Moisture Resistant; Operating Temperature: -55°C ~ 155°C; Tolerance: ±1%; Composition: Thick Film; Resistance (Ohms): 15k; Failure Rate: -; Height - Seated (Max): 0.016" (0.40mm); Packaging: Cut Tape (CT); Supplier Device Package: 0402; Size / Dimension: 0.039" L x 0.020" W (1.00mm x 0.50mm); Package / Case: 0402 (1005 Metric); Part Status: Active; Supplier 1: Digi-Key; Supplier Part Number 1: 311-15.0KLRCT-ND
R218 = Res_0402: Manufacturer: Yageo; Manufacturer Part Number 1: RC0402FR-07330KL; Part Description: 330 kOhms ±1% 0.063W, 1/16W Chip Resistor 0402 (1005 Metric) Moisture Resistant Thick Film; Power (Watts): 0.063W, 1/16W; Temperature Coefficient: ±100ppm/°C; Tolerance: ±1%; Supplier Part Number 1: 311-330KLRCT-ND; Packaging: Cut Tape (CT); Composition: Thick Film; Part Status: Active; Category: Resistors; Supplier 1: Digi-Key; RoHS: RoHS Compliant; Supplier Device Package: 0402; Package / Case: 0402 (1005 Metric); Height - Seated (Max): 0.016" (0.40mm); Failure Rate: -; Features: Moisture Resistant; Size / Dimension: 0.039" L x 0.020" W (1.00mm x 0.50mm); Operating Temperature: -55°C ~ 155°C; Value: 330k, 1%
R222 = Res_0402: Manufacturer Part Number 1: RC1005F2102CS; Manufacturer: Samsung Electro-Mechanics; Part Description: 21 kOhms ±1% 0.063W, 1/16W Chip Resistor 0402 (1005 Metric) Moisture Resistant Thick Film; Temperature Coefficient: ±100ppm/°C; Power (Watts): 0.063W, 1/16W; Packaging: Cut Tape (CT); Tolerance: ±1%; Failure Rate: -; Size / Dimension: 0.039" L x 0.020" W (1.00mm x 0.50mm); Supplier Part Number 1: 1276-3450-1-ND; RoHS: RoHS Compliant; Features: Moisture Resistant; Operating Temperature: -55°C ~ 155°C; Package / Case: 0402 (1005 Metric); Height - Seated (Max): 0.016" (0.40mm); Supplier 1: Digi-Key; Part Status: Active; Supplier Device Package: 0402; Composition: Thick Film; Category: Resistors; Value: 21k, 1%
R223 R226 R235 R240 R247 = Res_0402: Manufacturer: Stackpole Electronics Inc; Manufacturer Part Number 1: RMCF0402FT1K00; Part Description: RES SMD 1K OHM 1% 1/16W 0402; Temperature Coefficient: ±100ppm/°C; Power (Watts): 0.063W, 1/16W; Value: 1k, 1%; Supplier 1: Digi-Key; Supplier Part Number 1: RMCF0402FT1K00TR-ND; Resistance (Ohms): 1k; Packaging: Tape & Reel (TR); Category: Resistors; RoHS: RoHS Compliant; Tolerance: ±1%; Height: 0.016" (0.40mm); Number of Terminations: 2; Package / Case: 0402 (1005 Metric); Operating Temperature: -55°C ~ 155°C; Features: -; Composition: Thick Film; Supplier Device Package: 0402; Size / Dimension: 0.039" L x 0.020" W (1.00mm x 0.50mm)
R224 R250 R251 = Res_0402: Manufacturer Part Number 1: CRCW08050000Z0EA; Manufacturer: Vishay Dale; Part Description: RES SMD 0.0 OHM JUMPER 1/8W 0805; Power (Watts): 0.125W, 1/8W; Resistance (Ohms): 0.0; Tolerance: Jumper; Value: 0R; Supplier 1: Digi-Key; Supplier Part Number 1: 541-0.0ATR-ND; Package / Case: 0805 (2012 Metric); Height: 0.020" (0.50mm); Packaging: Tape & Reel (TR); Operating Temperature: -55°C ~ 155°C; Temperature Coefficient: -; RoHS: RoHS Compliant; Size / Dimension: 0.079" L x 0.049" W (2.00mm x 1.25mm); Supplier Device Package: 0805 (2012 Metric); Number of Terminations: 2; Category: Resistors; Features: Automotive AEC-Q200; Composition: Thick Film
R228 = Res_0402: Manufacturer Part Number 1: RMCF0402FT100R; Manufacturer: Stackpole Electronics Inc.; Part Description: RES SMD 100 OHM 1% 1/16W 0402; Power (Watts): 0.063W, 1/16W; Temperature Coefficient: ±100ppm/°C; Resistance (Ohms): 100; Value: 100R, 1%; Supplier 1: Digi-Key; Supplier Part Number 1: RMCF0402FT100RDKR-ND; Packaging: Digi-Reel®; Composition: Thick Film; Number of Terminations: 2; Package / Case: 0402 (1005 Metric); RoHS: RoHS Compliant; Category: Resistors; Size / Dimension: 0.039" L x 0.020" W (1.00mm x 0.50mm); Tolerance: ±1%; Supplier Device Package: 0402; Features: -; Height: 0.016" (0.40mm); Operating Temperature: -55°C ~ 155°C
R229 R245 = Res_0402: Manufacturer Part Number 1: RC0402JR-070RL; Manufacturer: Yageo; Part Description: RES SMD 0.0OHM JUMPER 1/16W 0402; Resistance (Ohms): 0.0; Tolerance: Jumper; Power (Watts): 0.063W, 1/16W; Value: 0R; Supplier 1: Digi-Key; Supplier Part Number 1: 311-0.0JRTR-ND; Category: Resistors; Temperature Coefficient: -; Features: Moisture Resistant; Supplier Device Package: 0402; Height: 0.016" (0.40mm); Package / Case: 0402 (1005 Metric); Operating Temperature: -55°C ~ 155°C; Size / Dimension: 0.039" L x 0.020" W (1.00mm x 0.50mm); Composition: Thick Film; Packaging: Tape & Reel (TR); Number of Terminations: 2; RoHS: RoHS Compliant
R231 R232 = Res_0402: Manufacturer: Yageo; Part Description: 470 mOhms ±5% 0.125W, 1/8W Chip Resistor 0805 (2012 Metric) Automotive AEC-Q200, Current Sense, Moisture Resistant Thick Film; Manufacturer Part Number 1: RL0805JR-070R47L; Tolerance: ±5%; Power (Watts): 0.125W, 1/8W; Temperature Coefficient: ±300ppm/°C; Value: 0.47R; Operating Temperature: -55°C ~ 155°C; Features: Automotive AEC-Q200, Current Sense, Moisture Resistant; Supplier 1: Digi-Key; Supplier Part Number 1: 311-0.47LVCT-ND; Size / Dimension: 0.079" L x 0.049" W (2.00mm x 1.25mm); Composition: Thick Film; Package / Case: 0805 (2012 Metric); RoHS: RoHS Compliant; Supplier Device Package: 0805; Category: Resistors; Packaging: Cut Tape (CT); Failure Rate: -; Height - Seated (Max): 0.024" (0.60mm); Part Status: Active
R234 = Res_0402: Manufacturer: Yageo; Manufacturer Part Number: RC0402FR-0712K4L; Part Description: RT0402BRE0712K4L; Temperature Coefficient: ±50ppm/°C; Power (Watts): 0.063W, 1/16W; Tolerance: ±0.1%; Supplier Part Number 1: YAG4337CT-ND; Supplier 1: Digi-Key; Category: Resistors; Packaging: Cut Tape (CT); RoHS: RoHS Compliant; Supplier Device Package: 0402; Composition: Thin Film; Size / Dimension: 0.039" L x 0.020" W (1.00mm x 0.50mm); Part Status: Active; Features: -; Height - Seated (Max): 0.014" (0.35mm); Failure Rate: -; Package / Case: 0402 (1005 Metric); Operating Temperature: -55°C ~ 155°C; Value: 12.4k, 1%; Manufacturer Part Number 1: RT0402BRE0712K4L
R236 = Res_0402: Manufacturer Part Number: CRCW0402560RFKED; Manufacturer: Vishay Dale; Part Description: RES SMD 560 OHM 1% 1/16W 0402; Resistance (Ohms): 560; Power (Watts): 0.063W, 1/16W; Temperature Coefficient: ±100ppm/°C; RoHS: RoHS Compliant; Packaging: Cut Tape (CT); Composition: Thick Film; Tolerance: ±1%; Number of Terminations: 2; Supplier Device Package: 0402 (1005 Metric); Operating Temperature: -55°C ~ 155°C; Features: Automotive AEC-Q200; Category: Resistors; Supplier Part Number 1: 541-560LCT-ND; Package / Case: 0402 (1005 Metric); Supplier 1: Digi-Key; Height: 0.016" (0.40mm); Size / Dimension: 0.039" L x 0.020" W (1.00mm x 0.50mm)
R237 R238 = Res_0402: Manufacturer: Yageo; Manufacturer Part Number: RC0402FR-07118KL; Temperature Coefficient: ±100ppm/°C; Power (Watts): 0.063W, 1/16W; Value: 118k, 1%; Package / Case: 0402 (1005 Metric); Packaging: Cut Tape (CT); Supplier Device Package: 0402; Features: Moisture Resistant; Part Status: Active; Failure Rate: -; Composition: Thick Film; Operating Temperature: -55°C ~ 155°C; Category: Resistors; Tolerance: ±1%; Supplier Part Number 1: YAG2369CT-ND; Supplier 1: Digi-Key; Size / Dimension: 0.039" L x 0.020" W (1.00mm x 0.50mm); RoHS: RoHS Compliant; Height - Seated (Max): 0.016" (0.40mm)
R239 = Res_0402: Manufacturer: Panasonic Electronic Components; Manufacturer Part Number 1: ERA-2AED471X; Power (Watts): 0.063W, 1/16W; Temperature Coefficient: ±25ppm/°C; Resistance (Ohms): 470; Value: 470R, 0.5%; Supplier 1: Digi-Key; Supplier Part Number 1: P470DETR-ND; Tolerance: ±0.5%; Packaging: Tape & Reel (TR); Number of Terminations: 2; Operating Temperature: -55°C ~ 155°C; RoHS: RoHS Compliant; Size / Dimension: 0.039" L x 0.020" W (1.00mm x 0.50mm); Composition: Thin Film; Package / Case: 0402 (1005 Metric); Height: 0.016" (0.40mm); Features: Automotive AEC-Q200; Supplier Device Package: 0402; Category: Resistors
R241 R242 = Res_0402: Manufacturer: Yageo; Manufacturer Part Number 1: RC0402JR-07150KL; Part Description: 150 kOhms ±5% 0.063W, 1/16W Chip Resistor 0402 (1005 Metric) Moisture Resistant Thick Film; Power (Watts): 0.063W, 1/16W; Tolerance: ±5%; Temperature Coefficient: ±100ppm/°C; Value: 150k, 1%; Operating Temperature: -55°C ~ 155°C; Composition: Thick Film; Category: Resistors; Height - Seated (Max): 0.016" (0.40mm); Failure Rate: -; Features: Moisture Resistant; Part Status: Active; Package / Case: 0402 (1005 Metric); Size / Dimension: 0.039" L x 0.020" W (1.00mm x 0.50mm); Packaging: Cut Tape (CT); Supplier 1: Digi-Key; Supplier Device Package: 0402; Supplier Part Number 1: 311-150KJRCT-ND; RoHS: RoHS Compliant
R243 = Res_0402: Manufacturer Part Number: RC0402FR-071K6L; Manufacturer: Yageo; Part Description: 1.6 kOhms ±1% 0.063W, 1/16W Chip Resistor 0402 (1005 Metric) Moisture Resistant Thick Film; Temperature Coefficient: ±100ppm/°C; Power (Watts): 0.063W, 1/16W; Value: 1.6k, 1%; Tolerance: ±1%; RoHS: RoHS Compliant; Package / Case: 0402 (1005 Metric); Height - Seated (Max): 0.016" (0.40mm); Supplier Device Package: 0402; Failure Rate: -; Composition: Thick Film; Part Status: Active; Size / Dimension: 0.039" L x 0.020" W (1.00mm x 0.50mm); Operating Temperature: -55°C ~ 155°C; Packaging: Cut Tape (CT); Features: Moisture Resistant; Supplier Part Number 1: YAG3045CT-ND; Category: Resistors; Supplier 1: Digi-Key
R244 = Res_0402: Manufacturer Part Number: RC0402FR-07750RL; Manufacturer: Yageo; Part Description: RES SMD 750 OHM 1% 1/16W 0402; Resistance (Ohms): 750; Power (Watts): 0.063W, 1/16W; Temperature Coefficient: ±100ppm/°C; Value: 750R, 1%; Tolerance: ±1%; Number of Terminations: 2; Supplier Device Package: 0402; Size / Dimension: 0.039" L x 0.020" W (1.00mm x 0.50mm); Height: 0.016" (0.40mm); Composition: Thick Film; Features: Moisture Resistant; Operating Temperature: -55°C ~ 155°C; Package / Case: 0402 (1005 Metric); Supplier 1: Digi-Key; RoHS: RoHS Compliant; Category: Resistors; Packaging: Cut Tape (CT); Supplier Part Number 1: 311-750LRCT-ND
R246 = Res_0402: Manufacturer Part Number: RC0402FR-07510RL; Manufacturer: Yageo; Part Description: 510 Ohms ±1% 0.063W, 1/16W Chip Resistor 0402 (1005 Metric) Moisture Resistant Thick Film; Temperature Coefficient: ±100ppm/°C; Power (Watts): 0.063W, 1/16W; Value: 510R, 1%; Operating Temperature: -55°C ~ 155°C; Part Status: Active; Tolerance: ±1%; Packaging: Cut Tape (CT); Features: Moisture Resistant; Composition: Thick Film; Supplier Device Package: 0402; Failure Rate: -; Package / Case: 0402 (1005 Metric); Height - Seated (Max): 0.016" (0.40mm); Size / Dimension: 0.039" L x 0.020" W (1.00mm x 0.50mm); Supplier 1: Digi-Key; RoHS: RoHS Compliant; Category: Resistors; Supplier Part Number 1: 311-510LRCT-ND
R248 = Res_0402: Manufacturer Part Number 1: RC0402FR-07187KL; Manufacturer: Yageo; Part Description: 187 kOhms ±1% 0.063W, 1/16W Chip Resistor 0402 (1005 Metric) Moisture Resistant Thick Film; Power (Watts): 0.063W, 1/16W; Temperature Coefficient: ±100ppm/°C; Value: 187k, 1%; Tolerance: ±1%; Height - Seated (Max): 0.016" (0.40mm); Package / Case: 0402 (1005 Metric); Supplier Device Package: 0402; Size / Dimension: 0.039" L x 0.020" W (1.00mm x 0.50mm); Category: Resistors; Composition: Thick Film; Features: Moisture Resistant; Supplier Part Number 1: 311-187KLRCT-ND; RoHS: RoHS Compliant; Part Status: Active; Supplier 1: Digi-Key; Packaging: Cut Tape (CT); Operating Temperature: -55°C ~ 155°C; Failure Rate: -
R249 = Res_0402: Manufacturer: Yageo; Manufacturer Part Number 1: RC0402FR-0782K5L; Part Description: 82.5 kOhms ±1% 0.063W, 1/16W Chip Resistor 0402 (1005 Metric) Moisture Resistant Thick Film; Power (Watts): 0.063W, 1/16W; Temperature Coefficient: ±100ppm/°C; Value: 82.5k, 1%; RoHS: RoHS Compliant; Operating Temperature: -55°C ~ 155°C; Packaging: Cut Tape (CT); Category: Resistors; Failure Rate: -; Supplier Part Number 1: 311-82.5KLRCT-ND; Part Status: Active; Tolerance: ±1%; Features: Moisture Resistant; Supplier Device Package: 0402; Height - Seated (Max): 0.016" (0.40mm); Supplier 1: Digi-Key; Composition: Thick Film; Size / Dimension: 0.039" L x 0.020" W (1.00mm x 0.50mm); Package / Case: 0402 (1005 Metric)
T5 = PoE13P-50L_Flyback_transformer_1: Part Description: Audio Transformers / Signal Transformers POE13P Flyback PoE 127uH 5.0 V 2.6 A; Manufacturer: Coilcraft; Manufacturer Part Number 1: POE13P-50LB; Turns Ratio: 1:0.25; Inductance: 127uh; DC Resistance (DCR): 222mR; Isolation Voltage: 1.5kV; Supplier 1: Mouser; Stock 1: 99; Pricing 1: 1=3.92, 10=3.53, 50=3.14, 100=2.75, 1000=2.11, 10000=2.11 (USD); Case/Package: 127; Packaging: Cut Tape; Package Quantity: 1; Length: 13.46mm; Height: 12.7mm; Width: 13mm; Lead Free: Contains Lead; REACH SVHC: No SVHC; Supplier Part Number 1: 994-POE13P-50LB
VD3 VD6 = DIODE_TVS_UNIDIR: SMAJ58A-TR; Manufacturer: Diodes Incorporated; Manufacturer Part Number 1: SMAJ58A-13-F; Part Description: TVS DIODE 58V 93.6V SMA; Current - Peak Pulse (10/1000µs): 4.3A; Voltage - Breakdown (Min): 64.4V; Power - Peak Pulse: 400W; Type: Zener; Voltage - Clamping (Max) @ Ipp: 93.6V; Voltage - Reverse Standoff (Typ): 58V; Power Line Protection: No; Base Part Number: SMAJ58; Category: Circuit Protection; Supplier Device Package: SMA; Supplier Part Number 1: SMAJ58A-13-FDICT-ND; Applications: General Purpose; RoHS: RoHS Compliant; Operating Temperature: -55°C ~ 150°C (TJ); Capacitance @ Frequency: -; Part Status: Active; Supplier 1: Digi-Key; Package / Case: DO-214AC, SMA; Mounting Type: Surface Mount; Packaging: Cut Tape (CT); Value: SMAJ58A